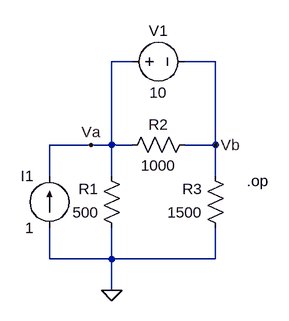
[diagram p0: schematic MNA_Current_test.asc]
MNA_Current_test.asc, the LTspice schematic file:
Version 4.1
SHEET 1 880 680
WIRE 144 -32 112 -32
WIRE 272 -32 224 -32
WIRE 80 96 16 96
WIRE 112 96 112 -32
WIRE 112 96 80 96
WIRE 144 96 112 96
WIRE 272 96 272 -32
WIRE 272 96 224 96
WIRE 16 144 16 96
WIRE 112 144 112 96
WIRE 272 144 272 96
WIRE 16 272 16 224
WIRE 112 272 112 224
WIRE 112 272 16 272
WIRE 272 272 272 224
WIRE 272 272 112 272
WIRE 112 320 112 272
FLAG 112 320 0
FLAG 272 96 Vb
FLAG 80 96 Va
SYMBOL current 16 224 R180
WINDOW 0 24 80 Left 2
WINDOW 3 24 0 Left 2
WINDOW 123 0 0 Left 0
WINDOW 39 0 0 Left 0
SYMATTR InstName I1
SYMATTR Value 1
SYMBOL res 240 80 R90
WINDOW 0 0 56 VBottom 2
WINDOW 3 32 56 VTop 2
SYMATTR InstName R2
SYMATTR Value 1000
SYMBOL res 128 240 R180
WINDOW 0 36 76 Left 2
WINDOW 3 36 40 Left 2
SYMATTR InstName R1
SYMATTR Value 500
SYMBOL res 288 240 R180
WINDOW 0 36 76 Left 2
WINDOW 3 36 40 Left 2
SYMATTR InstName R3
SYMATTR Value 1500
SYMBOL voltage 128 -32 R270
WINDOW 0 32 56 VTop 2
WINDOW 3 -32 56 VBottom 2
WINDOW 123 0 0 Left 0
WINDOW 39 0 0 Left 0
SYMATTR InstName V1
SYMATTR Value 10
TEXT 320 152 Left 2 !.op

The netlist it stands for:
* MNA_Current_test.asc
I1 0 Va 1
R2 Vb Va 1000
R1 0 Va 500
R3 0 Vb 1500
V1 Va Vb 10
.op
.backanno
.end